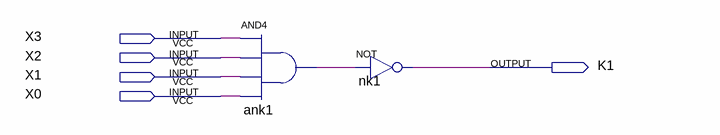
[diagram p0: schematic sheet]
// Quartus schematic K1.bdf as structural Verilog: 2 symbols, 5 pins
module K1 (
  input  X3,
  input  X2,
  input  X1,
  input  X0,
  output K1
);

  wire ank1_out;

  and ank1 (ank1_out, X3, X2, X1, X0);
  not nk1 (K1, ank1_out);
endmodule
